# EAGLE design Cansat2019_1516_Container_v05 (EAGLE 7.3.0)
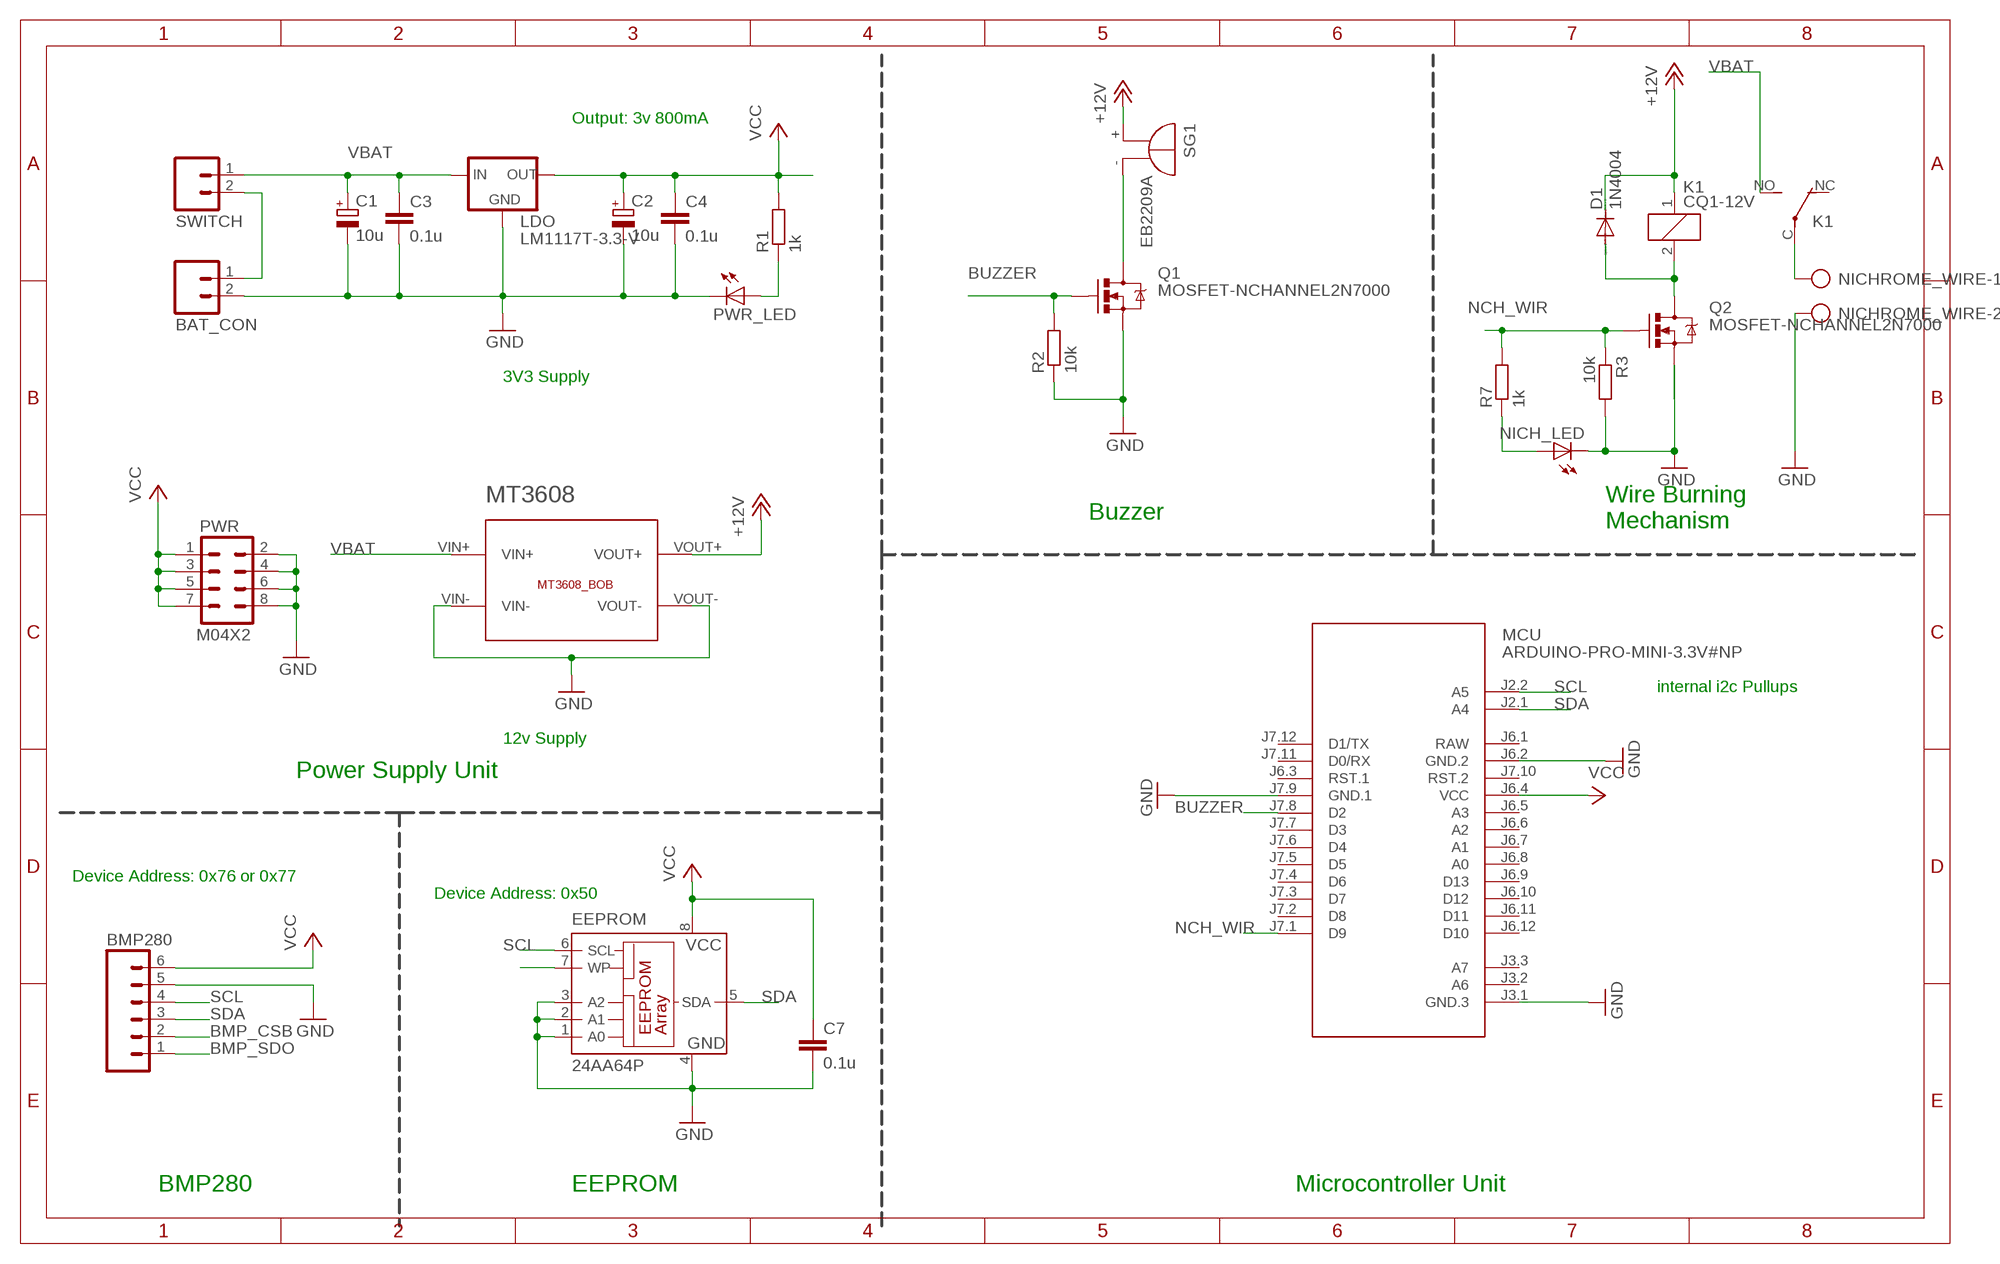
[diagram p0: schematic, sheet 1]

## Parts
BAT_CON  M02  [02P]
BMP280  M06  [06P]
C1  10u  CPOL-EUE2.5-6  [E2,5-6]
C2  10u  CPOL-EUE2.5-6  [E2,5-6]
C3  0.1u  C-EU025-025X050  [C025-025X050]
C4  0.1u  C-EU025-025X050  [C025-025X050]
C7  0.1u  C-EU025-025X050  [C025-025X050]
D1  1N4004  [DO41-10]
EEPROM  24AA64P  [DIL8]
K1  CQ1-12V  [CQ1]
LDO  LM1117T-3.3-V  [TO220V]
MCU  ARDUINO-PRO-MINI-3.3V#NP  [ARDUINO-PRO-MINI#NP]
MT3608  MT3608_BOB  [MT3608_BOB]
NICH_LED  LED3MM  [LED3MM]
NICHROME_WIRE  AK500/2-H  [AK500/2-H]
PWR  M04X2  [2X4]
PWR_LED  LED3MM  [LED3MM]
Q1  MOSFET-NCHANNEL2N7000  [TO-92]
Q2  MOSFET-NCHANNEL2N7000  [TO-92]
R1  1k  R-EU_0204/7  [0204/7]
R2  10k  R-EU_0204/7  [0204/7]
R3  10k  R-EU_0204/7  [0204/7]
R7  1k  R-EU_0204/7  [0204/7]
SG1  EB2209A  [EB2209A]
SWITCH  M02  [02P]

## Nets
+12V [power]: D1.C K1.1 MT3608.VOUT+ SG1.+
BMP_CSB: BMP280.2
BMP_SDO: BMP280.1
BUZZER: MCU.J7.8(D2) Q1.2(G) R2.2
GND [burner]: BAT_CON.2 BMP280.5 C1.- C2.- C3.2 C4.2 C7.2 EEPROM.1(A0) EEPROM.2(A1) EEPROM.3(A2) EEPROM.4(GND) LDO.1(GND) MCU.J3.1(GND.3) MCU.J6.2(GND.2) MCU.J7.9(GND.1) MT3608.VIN- MT3608.VOUT- NICH_LED.K(C) NICHROME_WIRE.2 PWR.2 PWR.4 PWR.6 PWR.8 PWR_LED.K(C) Q1.1(S) Q2.1(S) R2.1 R3.2
N$1 [power]: Q1.3(D) SG1.-
N$2 [burner]: K1.C(2:P) NICHROME_WIRE.1
N$3: PWR_LED.A R1.1
N$4: NICH_LED.A R7.1
N$6 [burner]: BAT_CON.1 SWITCH.2
N$7 [power]: D1.A K1.2 Q2.3(D)
N$8: EEPROM.7(WP)
NCH_WIR: MCU.J7.1(D9) Q2.2(G) R3.1 R7.2
SCL: BMP280.4 EEPROM.6(SCL) MCU.J2.2(A5)
SDA: BMP280.3 EEPROM.5(SDA) MCU.J2.1(A4)
VBAT [burner]: C1.+ C3.1 K1.NO(2:S) LDO.3(IN) MT3608.VIN+ SWITCH.1
VCC [power]: BMP280.6 C2.+ C4.1 C7.1 EEPROM.8(VCC) LDO.2(OUT) MCU.J6.4(VCC) PWR.1 PWR.3 PWR.5 PWR.7 R1.2
Unconnected: K1.NC(2:O) MCU.J3.2(A6) MCU.J3.3(A7) MCU.J6.3(RST.1) MCU.J6.5(A3) MCU.J6.6(A2) MCU.J6.7(A1) MCU.J6.8(A0) MCU.J6.9(D13) MCU.J6.10(D12) MCU.J6.11(D11) MCU.J6.12(D10) MCU.J7.2(D8) MCU.J7.3(D7) MCU.J7.4(D6) MCU.J7.5(D5) MCU.J7.6(D4) MCU.J7.7(D3) MCU.J7.10(RST.2) MCU.J7.11(D0/RX) MCU.J7.12(D1/TX)

## Notes on the sheet
- Output: 3v 800mA
- 3V3 Supply
- Buzzer
- Wire Burning
  Mechanism
- internal i2c Pullups
- 12v Supply
- Power Supply Unit
- Device Address: 0x76 or 0x77
- Device Address: 0x50
- BMP280 | EEPROM | Microcontroller Unit

## Power pins joined to a net without a drawn wire
RAW: MCU.J6.1(RAW)

## Library data of the parts
BAT_CON SWITCH = CEDT_JANUARY_2015_v5:M02: AMP QUICK CONNECTOR
BMP280 = con-amp-quick:M06: AMP QUICK CONNECTOR; OC_FARNELL: unknown; OC_NEWARK: unknown
C1 C2 = rcl:CPOL-EU: POLARIZED CAPACITOR, European symbol
C3 C4 C7 = rcl:C-EU: CAPACITOR, European symbol
D1 = diode:1N4004: DIODE general purpose rectifier, 1 A
EEPROM = microchip:24*: Serial EEPROM I2C; MF: MICROCHIP; MPN: 24AA64-I/P; OC_FARNELL: 1331303; OC_NEWARK: 92C6909
K1 = relay:CQ1-12V: AUTOMOTIVE QUIET RELAY NAiS Source: http://www.mew-europe.com/.. en_ds_61208_0000.pdf; OC_FARNELL: unknown; OC_NEWARK: unknown
LDO = lm1117:LM1117T-*
MCU = diy-modules:ARDUINO-PRO-MINI-*#NP: Arduino Pro Mini (and compatible devices) without programming pads More details available here: https://www.arduino.cc/en/Main/ArduinoBoardProMini Click here to find device on ebay.com <http://www.ebay.com/sch/arduino+pro+mini>
MT3608 = Breakouts:MT3608_BOB
NICH_LED PWR_LED = 01_adafruit:LED: LED OSRAM: - CHIPLED LG R971, LG N971, LY N971, LG Q971, LY Q971, LO R971, LY R971 LH N974, LH R974 LS Q976, LO Q976, LY Q976 LO Q996 - Hyper CHIPLED LW Q18S LB Q993, LB Q99A, LB R99A - SideLED LS A670, LO A670, LY A670, LG A670, LP A670 LB A673, LV A673, LT A673, LW A673 LH A674 LY A675 LS A676, LA A676, LO A676, LY A676, LW A676 LS A679, LY A679, LG A679 - Hyper Micro SIDELED® LS Y876, LA Y876, LO Y876, LY Y876 LT Y87S - SmartLED LW L88C, LW L88S LB L89C, LB L89S, LG L890 LS L89K, LO L89K, LY L89K LS L896, LA L896, LO L896, LY L896 - TOPLED LS T670, LO T670, LY T670, LG T670, LP T670 LSG T670, LSP T670, LSY T670, LOP T670, LYG T670 LG T671, LOG T671, LSG T671 LB T673, LV T673, LT T673, LW T673 LH T674 LS T676, LA T676, LO T676, LY T676, LB T676, LH T676, LSB T676, LW T676 LB T67C, LV T67C, LT T67C, LS T67K, LO T67K, LY T67K, LW E67C LS E67B, LA E67B, LO E67B, LY E67B, LB E67C, LV E67C, LT E67C LW T67C LS T679, LY T679, LG T679 LS T770, LO T770, LY T770, LG T770, LP T770 LB T773, LV T773, LT T773, LW T773 LH T774 LS E675, LA E675, LY E675, LS T675 LS T776, LA T776, LO T776, LY T776, LB T776 LHGB T686 LT T68C, LB T68C - Hyper Mini TOPLED® LB M676 - Mini TOPLED Santana® LG M470 LS M47K, LO M47K, LY M47K Source: http://www.osram.convergy.de/
NICHROME_WIRE = con-ptr500:AK500/2-H: CONNECTOR Aug. 2004 / PTR Meßtechnik: Die Bezeichnung der Serie AK505 wurde geändert. Es handelt sich hierbei um AK500 in horizontaler Ausführung.; OC_FARNELL: unknown; OC_NEWARK: unknown
PWR = SparkFun-Connectors:M04X2: .1" header, two rows of four.
Q1 Q2 = SparkFun-DiscreteSemi:MOSFET-NCHANNEL: Common NMOSFET Parts MFG P/N Store ID Prod ID FDD8780 TRANS-09984 SI7820DN TRANS-11055 FDS6630A IC-08089 2N7002PW TRANS-11151 FQP30N06L COM-10213 TRANS-10060 BSS123LT1G TRANS-08345 BSS138 TRANS-00830 BS170 2N7000
R1-R3 R7 = rcl:R-EU_: RESISTOR, European symbol
SG1 = buzzer:EB2209A: BUZZER Source: Buerklin; OC_FARNELL: unknown; OC_NEWARK: unknown

## Net classes
0 default: width 0.305 mm, clearance 0.305 mm
1 power: width 0.61 mm, clearance 0.305 mm
2 burner: width 0.813 mm, clearance 0.305 mm

## Board
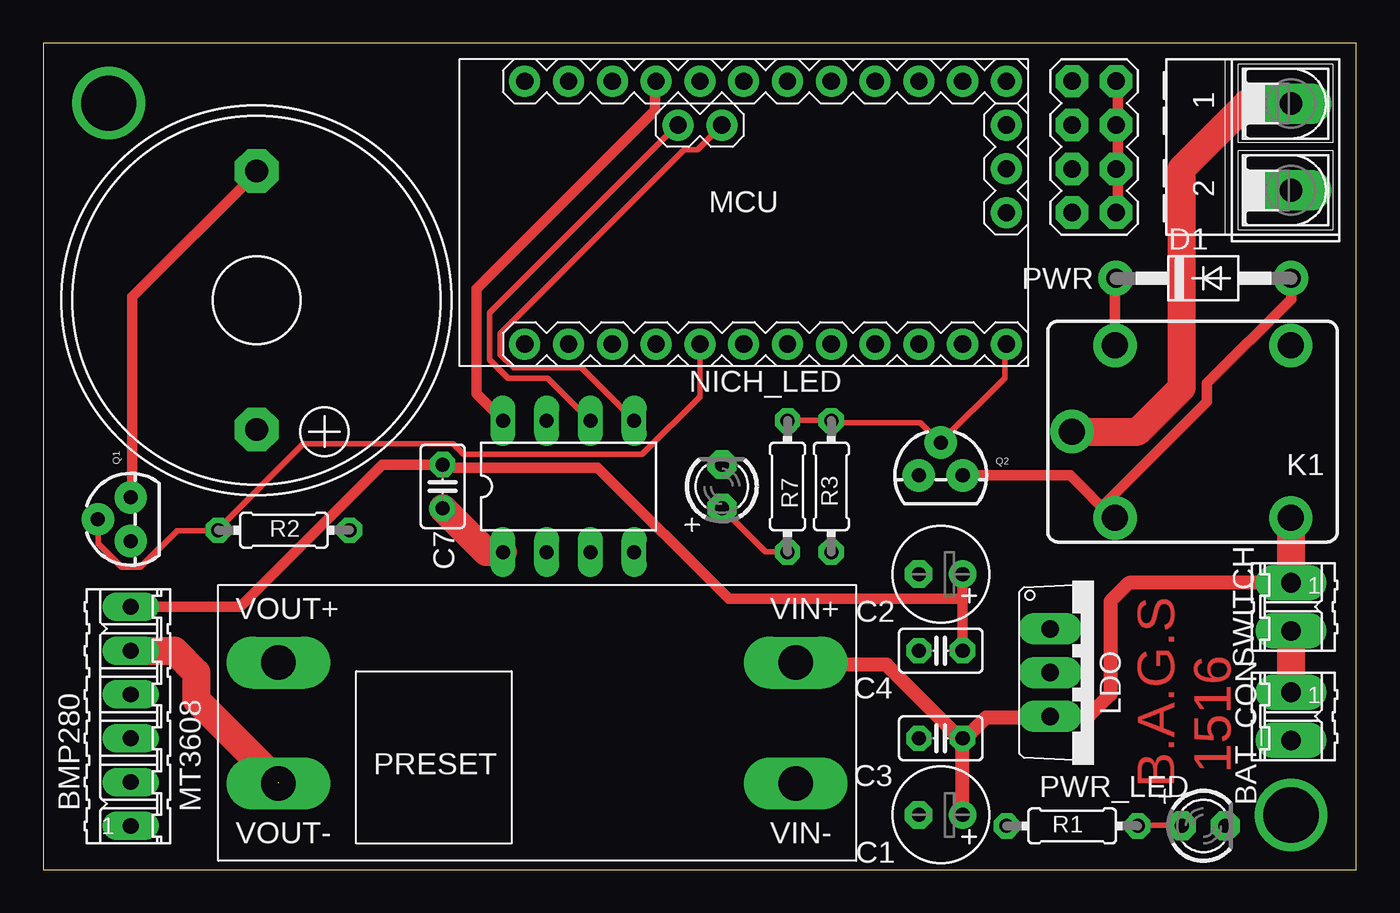
[diagram p1: board, top side]
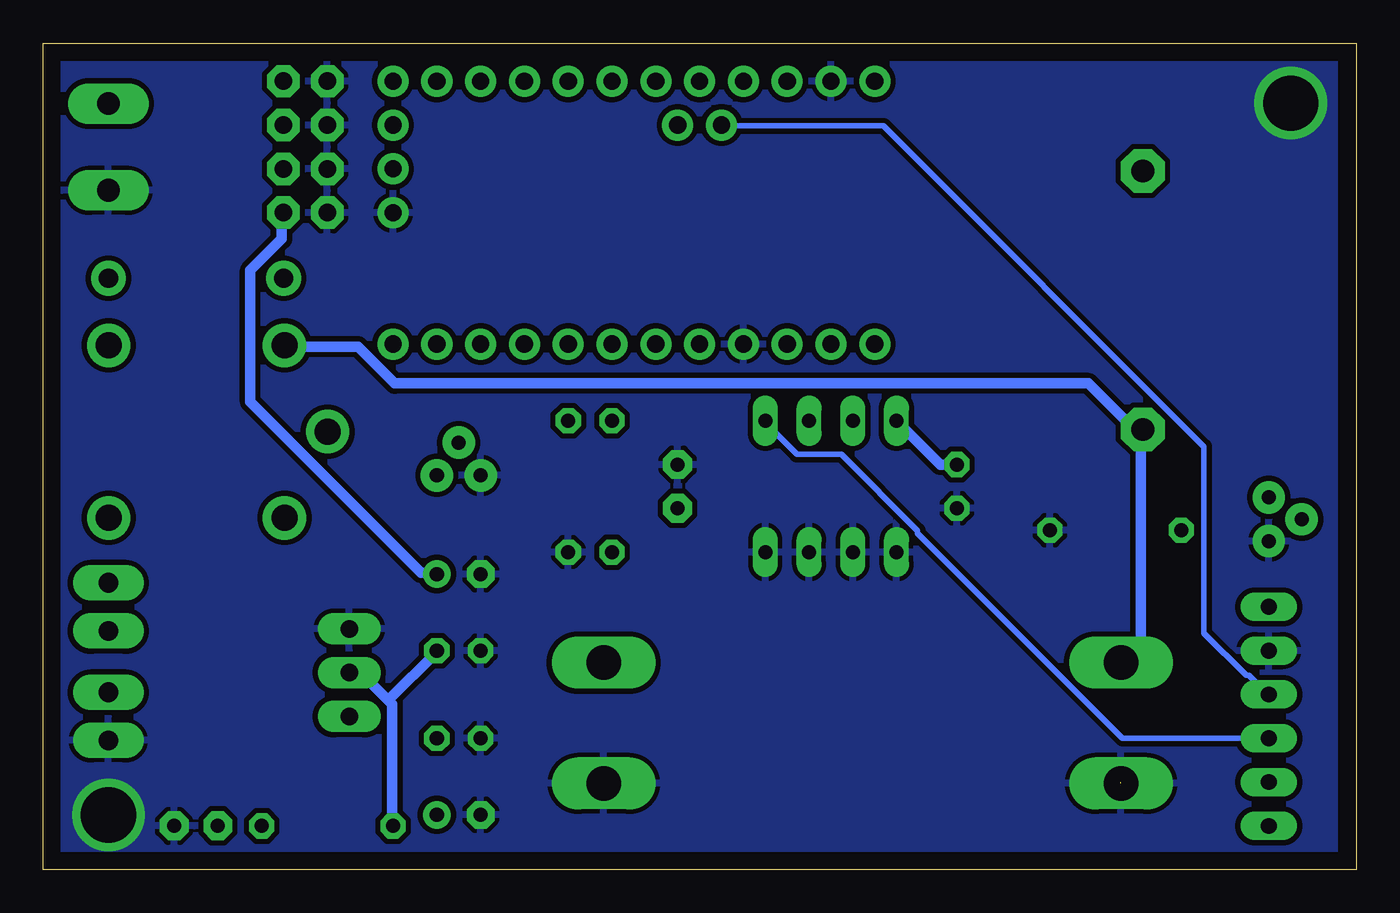
[diagram p2: board, bottom side, seen from below]

Size 76.18 x 47.93 mm. Coordinates in mm from the lower left corner, seen from the top.
Outline: 0,0 76.18,0 76.18,47.93 0,47.93 0,0
Copper layers (1*16): Top 0.035mm / dielectric 1.5mm / Bottom 0.035mm
Design rules "8085_board": minimum track width 10mil, minimum drill 24mil, track to track 8mil, track to pad 8mil, pad to pad 8mil, via to via 8mil, smd to smd 8mil, copper to edge 40mil, drill to drill 8mil, minimum pad ring 12mil, minimum via ring 12mil, stop-mask expansion 4mil, vias tented up to drill 0mil, thermal gap 10mil

### Footprints (pad centres in the part's own frame; a part is rotated, then mirrored left to right if it is on the bottom)
02P = drill 1.143 long: 1 -1.397,0; 2 1.397,0
06P = drill 0.914 long: 1 -6.35,0; 2 -3.81,0; 3 -1.27,0; 4 1.27,0; 5 3.81,0; 6 6.35,0
E2,5-6 = drill 0.813 pad 1.6: + -1.27,0 | drill 0.813 pad 1.6 octagon: - 1.27,0
C025-025X050 = drill 0.813 octagon: 1 -1.27,0; 2 1.27,0
DO41-10 = drill 1.118: A 5.08,0; C -5.08,0
DIL8 = drill 0.813 long: 1 -3.81,-3.81; 2 -1.27,-3.81; 3 1.27,-3.81; 4 3.81,-3.81; 5 3.81,3.81; 6 1.27,3.81; 7 -1.27,3.81; 8 -3.81,3.81
CQ1 = drill 1.5: 1 4.5,-5; 2 4.5,5; C 7,0; NC -5.7,-5; NO -5.7,5
TO220V = drill 1.016 long: 1 -2.54,-2.54; 2 0,-2.54; 3 2.54,-2.54
ARDUINO-PRO-MINI#NP = drill 1: J2.1 -1.27,5.08; J2.2 -3.81,5.08; J3.1 15.24,0; J3.2 15.24,2.54; J3.3 15.24,5.08; J6.1 -12.7,7.62; J6.2 -10.16,7.62; J6.3 -7.62,7.62; J6.4 -5.08,7.62; J6.5 -2.54,7.62; J6.6 0,7.62; J6.7 2.54,7.62; J6.8 5.08,7.62; J6.9 7.62,7.62; J6.10 10.16,7.62; J6.11 12.7,7.62; J6.12 15.24,7.62; J7.1 15.24,-7.62; J7.2 12.7,-7.62; J7.3 10.16,-7.62; J7.4 7.62,-7.62; J7.5 5.08,-7.62; J7.6 2.54,-7.62; J7.7 0,-7.62; J7.8 -2.54,-7.62; J7.9 -5.08,-7.62; J7.10 -7.62,-7.62; J7.11 -10.16,-7.62; J7.12 -12.7,-7.62
MT3608_BOB = drill 2 pad 3 long: VIN+ 33.5,-4.5; VIN- 33.5,-11.5; VOUT+ 3.5,-4.5; VOUT- 3.5,-11.5
LED3MM = drill 0.813 pad 1.676 octagon: A -1.27,0; K 1.27,0
AK500/2-H = drill 1.321 long: 1 -2.515,0; 2 2.515,0
2X4 = drill 1.016 pad 1.88 octagon: 1 -3.81,-1.27; 2 -3.81,1.27; 3 -1.27,-1.27; 4 -1.27,1.27; 5 1.27,-1.27; 6 1.27,1.27; 7 3.81,-1.27; 8 3.81,1.27
TO-92 = drill 0.813 pad 1.88: 1 -1.27,0; 2 0,1.905; 3 1.27,0
0204/7 = drill 0.813 octagon: 1 -3.81,0; 2 3.81,0
EB2209A = drill 1.321 pad 2.54 octagon: + 7.493,0; - -7.493,0

### Placement (x,y rotation side)
BAT_CON  72.39,8.89 270 top
BMP280  5.08,8.89 90 top
C1  52.07,3.17 180 top
C2  52.07,17.14 180 top
C3  52.07,7.62 180 top
C4  52.07,12.7 180 top
C7  23.18,22.23 270 top
D1  67.31,34.29 0 top
EEPROM  30.48,22.23 0 top
K1  66.67,25.4 180 top
LDO  60.96,11.43 270 top
MCU  40.64,38.1 0 top
MT3608  10.16,16.51 0 top
NICH_LED  39.37,22.23 90 top
NICHROME_WIRE  72.39,41.91 270 top
PWR  60.96,41.91 90 top
PWR_LED  67.31,2.54 0 top
Q1  5.08,20.32 90 top
Q2  52.07,22.86 0 top
R1  59.69,2.54 180 top
R2  13.97,19.68 180 top
R3  45.72,22.23 270 top
R7  43.18,22.23 90 top
SG1  12.38,33.02 270 top
SWITCH  72.39,15.24 270 top

### Tracks (layer width: path | path; a pad name or v marks a point on that pad's centre or on a via)
+12V
  Top 0.61: D1.C 62.18,34.29 62.18,30.48 K1.1
  Bottom 0.61: MT3608.VOUT+ 13.56,12.04 12.5,13.11 12.5,25.45 SG1.+ 12.8,25.45 15.54,28.19 55.78,28.19 57.91,30.33 62.03,30.33 K1.1
BUZZER
  Top 0.305: Q1.2 3.2,20.27 3.2,18.9 4.57,17.53 5.64,17.53 7.77,19.66 10.06,19.66 R2.2 10.21,19.81 15.09,24.69 23.77,24.69 24.38,24.08 34.75,24.08 38.1,27.43 MCU.J7.8
GND  (via drill 3.2)  (1 unrouted)
  Top 1.626: EEPROM.1 25.72,18.41 C7.2 | BMP280.5 7.62,12.7 8.89,11.43 8.89,9.84 13.65,5.08
  other vias: 72.39,3.17 3.81,44.45
  pour Bottom: 1.27,48.26 1.27,0 76.2,0 76.2,48.26
N$1
  Top 0.61: Q1.3 5.18,21.64 5.18,33.22 12.34,40.39 SG1.-
N$2
  Top 1.626: K1.C 63.5,25.4 66.04,27.94 66.04,40.64 69.85,44.45 72.36,44.45 NICHROME_WIRE.1
N$3
  Top 0.305: R1.1 63.55,2.59 65.99,2.59 PWR_LED.A
N$4
  Top 0.305: R7.1 43.13,18.44 41.91,18.44 39.47,20.88 NICH_LED.A
N$6
  Top 1.626: BAT_CON.1 SWITCH.2
N$7
  Top 0.61: Q2.3 59.59,22.86 62.03,20.42 K1.2 61.57,21.18 67.51,27.13 67.51,28.19 72.39,33.07 D1.A
NCH_WIR
  Top 0.305: R7.2 43.28,26.06 45.72,26.06 R3.1 45.72,25.91 50.9,25.91 51.97,24.84 Q2.2 52.12,24.84 55.78,28.5 55.78,30.48 MCU.J7.1
SCL
  Top 0.305: EEPROM.6 31.7,26.06 29.26,28.5 26.98,28.5 25.91,29.57 25.91,32.31 36.73,43.13 MCU.J2.2
  Bottom 0.305: BMP280.4 5.18,10.21 6.25,11.28 6.4,11.28 8.84,13.72 8.84,24.54 27.43,43.13 36.73,43.13 MCU.J2.2
SDA
  Top 0.305: MCU.J2.1 37.95,41.76 37.19,41.76 26.52,31.09 26.52,29.87 27.28,29.11 31.24,29.11 34.29,26.06 EEPROM.5
  Bottom 0.305: BMP280.3 13.56,7.62 25.45,19.51 25.45,19.66 29.87,24.08 32.46,24.08 34.29,25.91 EEPROM.5
VBAT
  Top 0.813: C1.+ C3.1 | C3.1 53.65,7.77 54.71,8.84 58.37,8.84 LDO.3 60.64,8.89 61.91,10.16 61.91,15.56 62.99,16.64 SWITCH.1 | MT3608.VIN+ 43.74,11.89 48.92,11.89 53.03,7.77 C3.1
  Top 1.626: SWITCH.1 72.39,20.39 K1.NO
VCC
  Top 0.61: PWR.1 62.33,38.1 62.33,40.54 PWR.3 62.33,40.84 62.33,43.13 PWR.5 62.33,43.43 62.33,45.72 PWR.7 | C2.+ 53.34,15.7 | 53.34,15.7 C4.1 | BMP280.6 11.43,15.24 19.66,23.47 23.16,23.47 C7.1 23.32,23.32 32.16,23.32 39.78,15.7 53.34,15.7 | MCU.J6.4 35.51,45.72 35.51,44.04 25.15,33.68 25.15,27.58 26.67,26.06 EEPROM.8
  Bottom 0.61: 55.93,2.59 R1.2 55.93,2.74 55.93,9.6 56.16,9.83 | C7.1 24.13,23.5 EEPROM.8 | 56.16,9.83 57.76,11.43 LDO.2 | 56.16,9.83 53.34,12.65 C4.1 | PWR.1 62.33,38.1 62.33,36.58 64.16,34.75 64.16,27.13 54.25,17.22 53.34,17.22 C2.+

### Text on the board
Top: B.A.G.S / 1516